# EAGLE schematic MIC-Board (EAGLE 8.0.1)
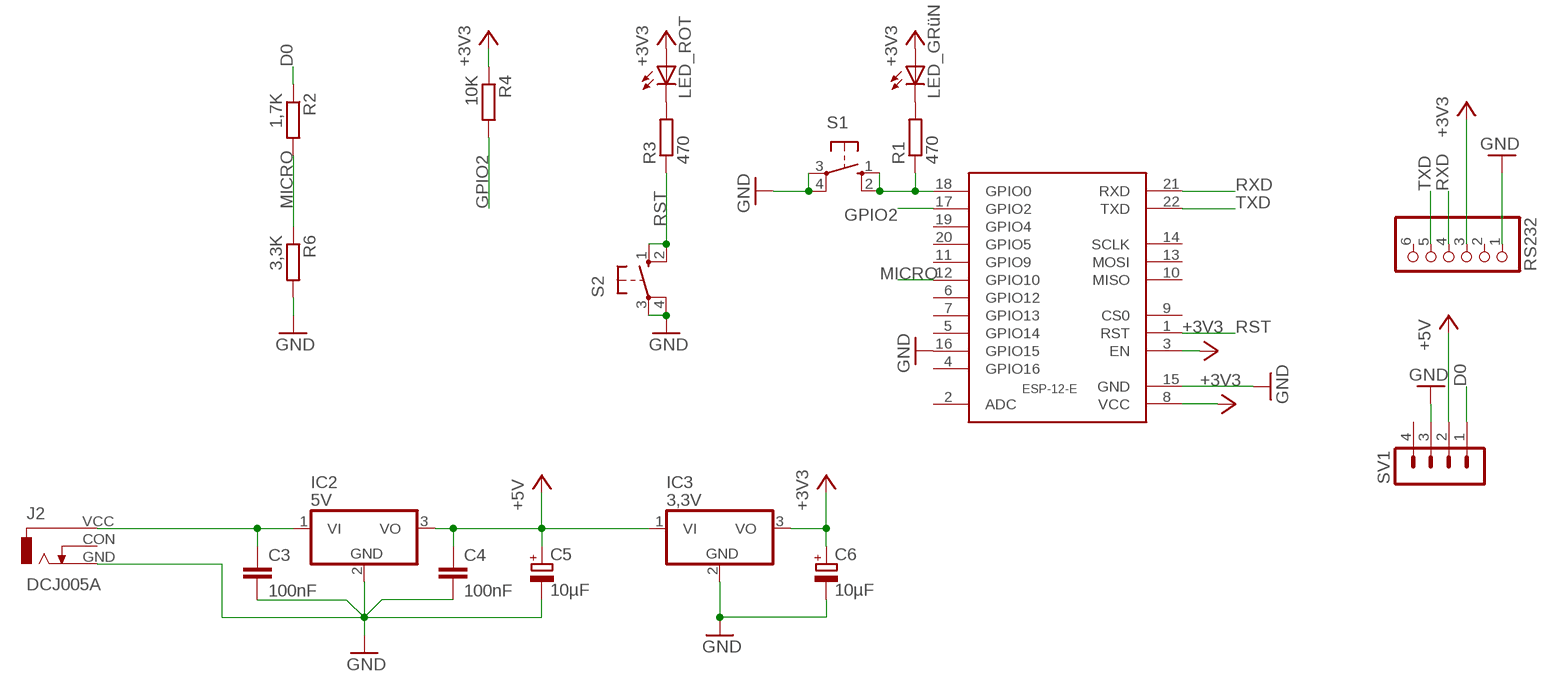
[diagram p0: schematic, sheet 1]

## Parts
C3  100nF  C-EU050-030X075  [C050-030X075]
C4  100nF  C-EU050-030X075  [C050-030X075]
C5  10µF  CPOL-EUE2.5-6  [E2,5-6]
C6  10µF  CPOL-EUE2.5-6  [E2,5-6]
IC2  5V  7805TV  [TO220V]
IC3  3,3V  7805TV  [TO220V]
J2  DCJ005A  [DC005A]
LED_GRüN  LED5MM  [LED5MM]
LED_ROT  LED5MM  [LED5MM]
R1  470  R-EU_0207/10  [0207/10]
R2  1,7K  R-EU_0207/10  [0207/10]
R3  470  R-EU_0207/10  [0207/10]
R4  10K  R-EU_0207/10  [0207/10]
R6  3,3K  R-EU_0207/10  [0207/10]
RS232  PINHD-1X6  [1X06]
S1  10-XX  [B3F-10XX]
S2  10-XX  [B3F-10XX]
SV1  MA04-1  [MA04-1]
U$1  ESP-12-E  [ESP-12-E]

## Nets
+3V3: C6.+ IC3.3(VO) LED_GRüN.A LED_ROT.A R4.1 RS232.3 U$1.3(EN) U$1.8(VCC)
+5V: C4.1 C5.+ IC2.3(VO) IC3.1(VI) SV1.2
D0: R2.1 SV1.1
GND: C3.2 C4.2 C5.- C6.- IC2.2(GND) IC3.2(GND) J2.GND R6.2 RS232.1 S1.3(P) S1.4(P1) S2.3(P) S2.4(P1) SV1.3 U$1.15(GND) U$1.16(GPIO15)
GPIO2: R4.2 U$1.17(GPIO2)
MICRO: R2.2 R6.1 U$1.12(GPIO10)
N$1: R1.1 S1.1(S) S1.2(S1) U$1.18(GPIO0)
N$2: C3.1 IC2.1(VI) J2.VCC
N$3: LED_GRüN.K(C) R1.2
N$4: LED_ROT.K(C) R3.2
RST: R3.1 S2.1(S) S2.2(S1) U$1.1(RST)
RXD: RS232.4 U$1.21(RXD)
TXD: RS232.5 U$1.22(TXD)
Unconnected: J2.CON RS232.2 RS232.6 SV1.4 U$1.2(ADC) U$1.4(GPIO16) U$1.5(GPIO14) U$1.6(GPIO12) U$1.7(GPIO13) U$1.9(CS0) U$1.10(MISO) U$1.11(GPIO9) U$1.13(MOSI) U$1.14(SCLK) U$1.19(GPIO4) U$1.20(GPIO5)

## Library data of the parts
C3 C4 = rcl:C-EU: CAPACITOR, European symbol
C5 C6 = rcl:CPOL-EU: POLARIZED CAPACITOR, European symbol
IC2 IC3 = linear:78*: Positive VOLTAGE REGULATOR Source: http://cache.national.com/ds/LM/LM78L05.pdf http://www.fairchildsemi.com/ds/LM/LM7805.pdf
J2 = !Häufige Bauteile:DCJ005A: DC POWER JACK Source: DCJ0202.pdf; OC_FARNELL: unknown; OC_NEWARK: unknown
LED_GRüN LED_ROT = !Häufige Bauteile:LED5MM
R1-R4 R6 = rcl:R-EU_: RESISTOR, European symbol
RS232 = pinhead:PINHD-1X6: PIN HEADER
S1 S2 = switch-omron:10-XX: OMRON SWITCH; MPN: B3F-1000; OC_FARNELL: 176432; OC_NEWARK: 36M3542
SV1 = con-lstb:MA04-1: PIN HEADER; OC_FARNELL: unknown; OC_NEWARK: unknown
U$1 = !Eigene Library SMD:ESP-12-E